# Altium schematic sheet MCU.SchDoc: Wacky Racers Racer
size A3; DrawnBy: Mark Arunchayanon, Abhi Chhabara, Luke Trenberth, Sasiru Goonatilake; Address1: ECE Department; Address2: University of Canterbury; Address3: Christchurch 8041; Address4: New Zealand; Revision: 1
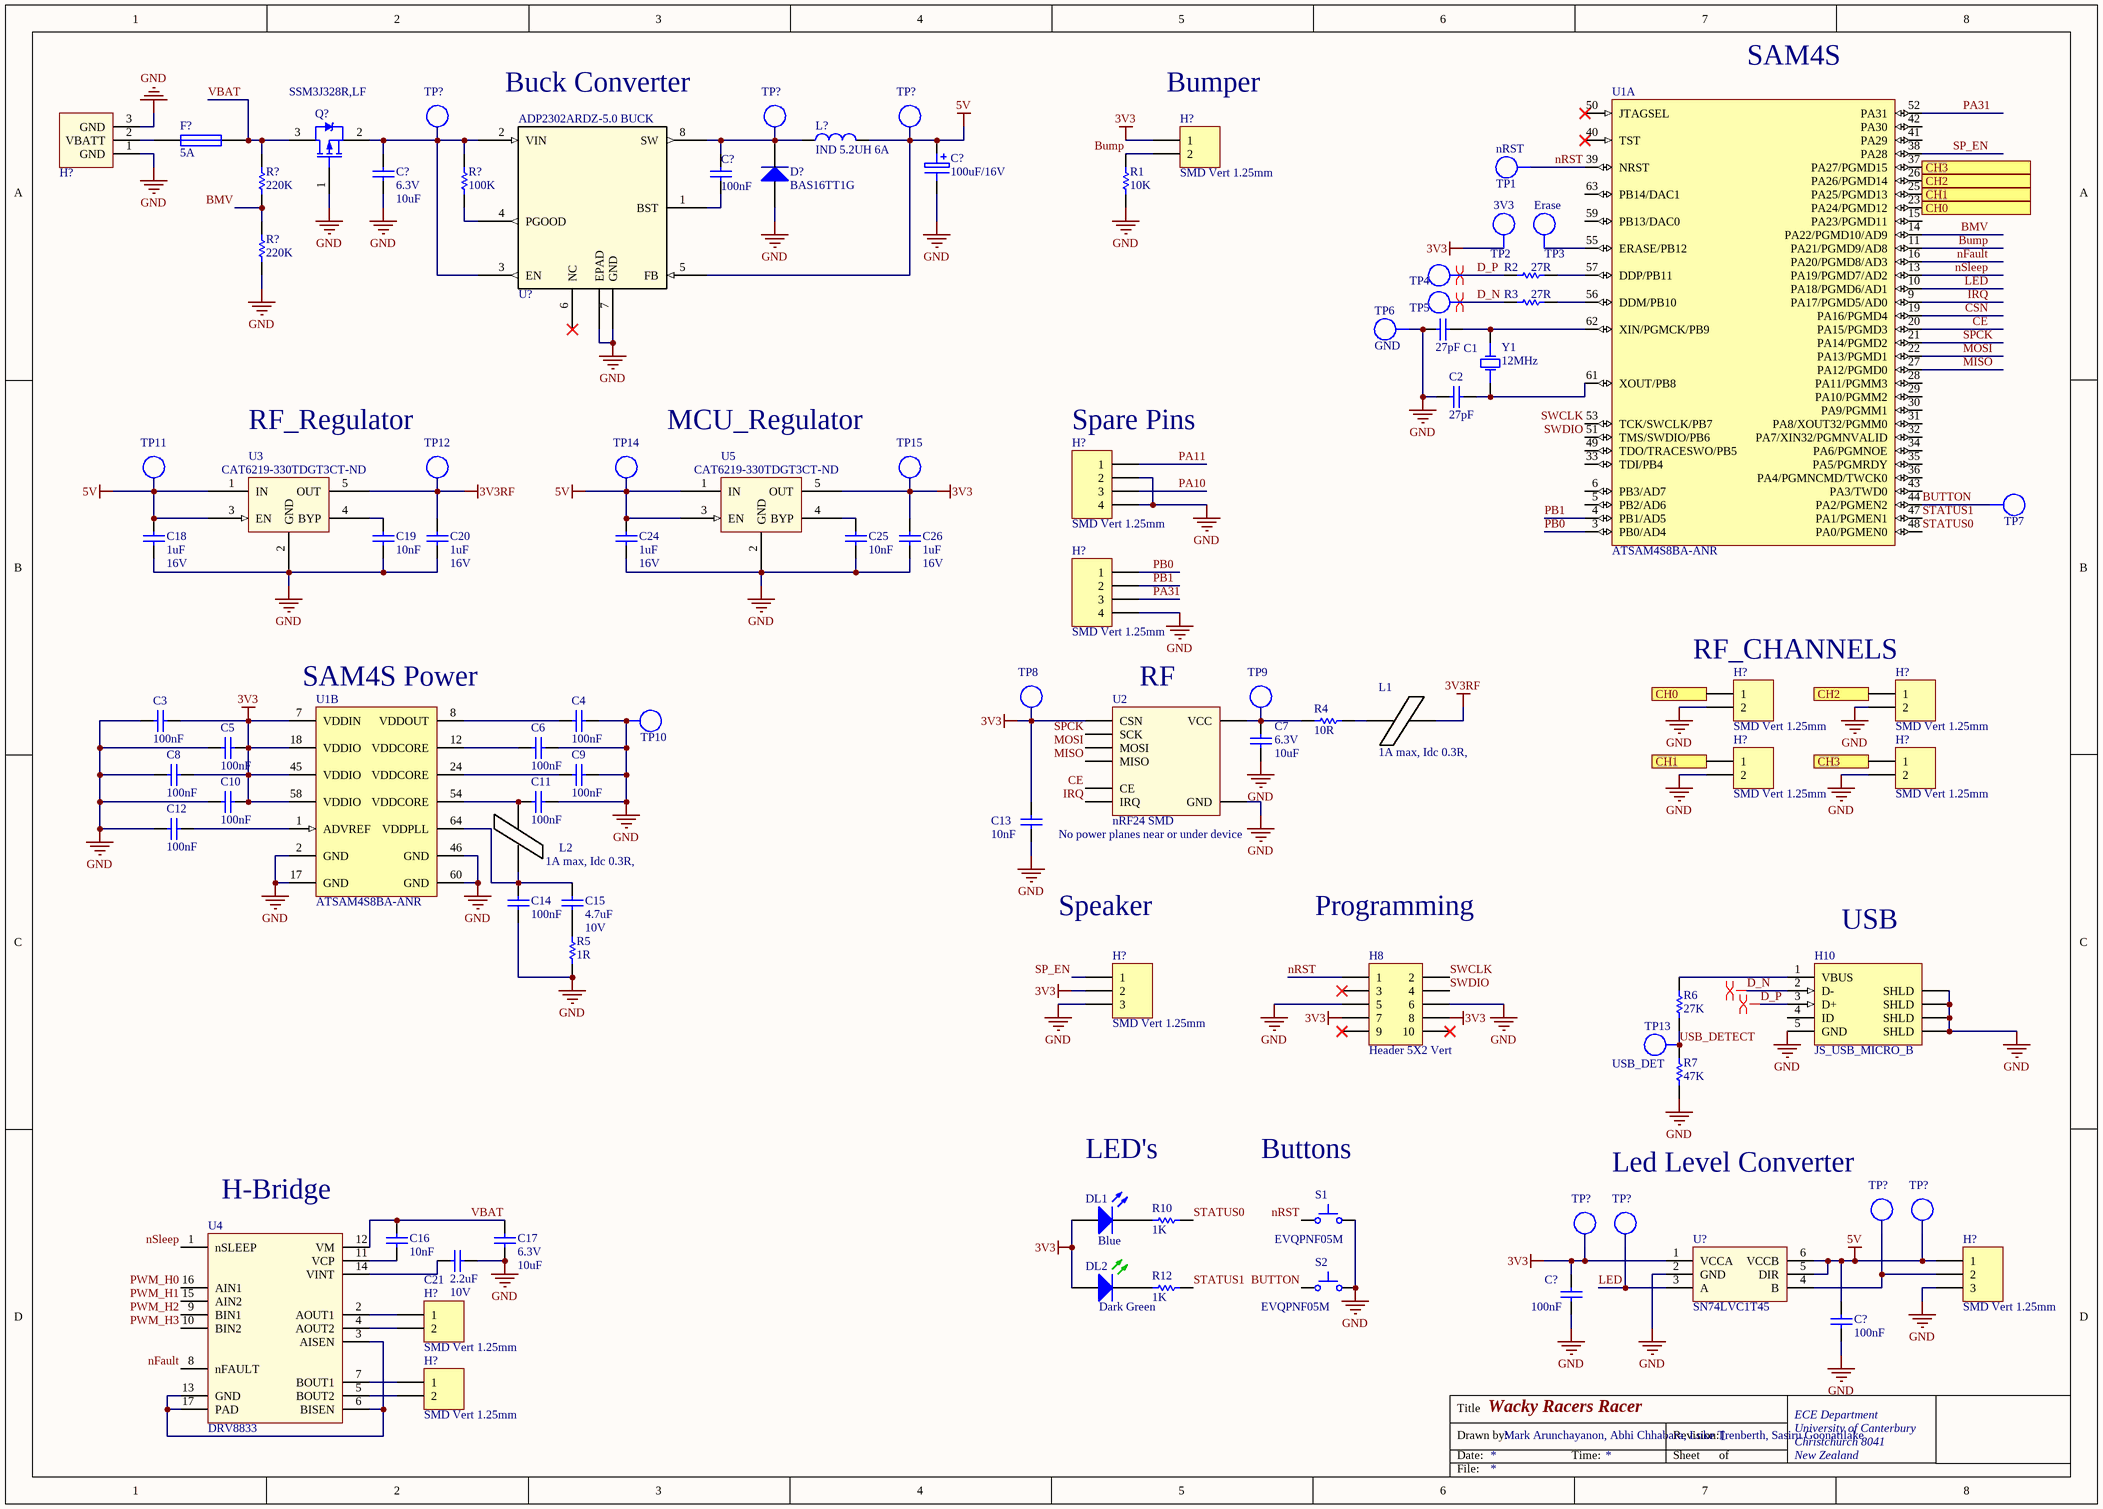
[diagram p0: MCU.SchDoc]

## Parts
(Parts that share a designator on the sheet are numbered #1, #2 ... from top to bottom, then left to right.)
C1  27pF  [CAPC1608L]
C2  27pF  [CAPC1608L]
C3  100nF  [CAPC1608L]
C4  100nF  [CAPC1608L]
C5  100nF  [CAPC1608L]
C6  100nF  [CAPC1608L]
C7  Voltage - Rated: 6.3V  [CAPC1608L]  (hidden comment: 10uF)
C8  100nF  [CAPC1608L]
C9  100nF  [CAPC1608L]
C10  100nF  [CAPC1608L]
C11  100nF  [CAPC1608L]
C12  100nF  [CAPC1608L]
C13  10nF  [CAPC1608L]
C14  100nF  [CAPC1608L]
C15  Max Voltage: 10V  [CAPC1608N]  (hidden comment: 4.7uF)
C16  10nF  [CAPC1608L]
C17  Voltage - Rated: 6.3V  [CAPC1608L]  (hidden comment: 10uF)
C18  Max Voltage: 16V  [CAPC1608L]  (hidden comment: 1uF)
C19  10nF  [CAPC1608L]
C20  Max Voltage: 16V  [CAPC1608L]  (hidden comment: 1uF)
C21  Max Voltage: 10V  [CAPC1608L]  (hidden comment: 2.2uF)
C24  Max Voltage: 16V  [CAPC1608L]  (hidden comment: 1uF)
C25  10nF  [CAPC1608L]
C26  Max Voltage: 16V  [CAPC1608L]  (hidden comment: 1uF)
C?#1  100nF  [CAPC1608L]
C?#2  100uF/16V  [NICH-1]
C?#3  Voltage - Rated: 6.3V  [CAPC1608L]  (hidden comment: 10uF)
C?#4  100nF  [CAPC1608L]
C?#5  100nF  [CAPC1608L]
D?  BAS16TT1G  [SOT416]
DL1  Blue  [WL-SMCW0603]
DL2  Dark Green  [WL-SMCW0603]
F?  5A  [RESC3216N]
H8  Header 5X2 Vert  [IDC2.54-V10D]
H10  JS_USB_MICRO_B  [FCI_USB_10118194-0001LF]
H?#1  SMD Vert 1.25mm  [SD-53398-0219]
H?#2  Battery_HEADER_3pin  [BATT_HEADER_3POS]  (value not drawn)
H?#3  SMD Vert 1.25mm  [SD-53398-0419]
H?#4  SMD Vert 1.25mm  [SD-53398-0419]
H?#5  SMD Vert 1.25mm  [SD-53398-0219]
H?#6  SMD Vert 1.25mm  [SD-53398-0219]
H?#7  SMD Vert 1.25mm  [SD-53398-0219]
H?#8  SMD Vert 1.25mm  [SD-53398-0219]
H?#9  SMD Vert 1.25mm  [SD-53398-0319]
H?#10  SMD Vert 1.25mm  [SD-53398-0319]
H?#11  SMD Vert 1.25mm  [SD-53398-0219]
H?#12  SMD Vert 1.25mm  [SD-53398-0219]
L1  1A max, Idc 0.3R,  [INDC3216L]
L2  1A max, Idc 0.3R,  [INDC3216L]
L?  IND 5.2UH 6A  [INDUCTOR5u2]
Q?  SSM3J328R,LF  [SOT23_L]
R1  10K  [RESC1608L]
R2  27R  [RESC3216L]
R3  27R  [RESC3216L]
R4  10R  [RESC1608L]
R5  1R  [RESC3216L]
R6  27K  [RESC1608L]
R7  47K  [RESC1608N]
R10  1K  [RESC1608L]
R12  1K  [RESC1608L]
R?#1  220K  [RESC1608L]
R?#2  100K  [RESC1608L]
R?#3  220K  [RESC1608L]
S1  EVQPNF05M  [EVQPNF05M]
S2  EVQPNF05M  [EVQPNF05M]
TP1  nRST  [TP_1206]  (no BOM)
TP2  3V3  [TP_1206]  (no BOM)
TP3  Erase  [TP_1206]  (no BOM)
TP4  TP  [TP_1206]  (value not drawn)  (no BOM)
TP5  TP  [TP_1206]  (value not drawn)  (no BOM)
TP6  GND  [TP_1206]  (no BOM)
TP7  TP  [TP_1206]  (value not drawn)  (no BOM)
TP8  TP_0603  [TP_0603]  (value not drawn)
TP9  TP_0603  [TP_0603]  (value not drawn)
TP10  TP  [TP_1206]  (value not drawn)  (no BOM)
TP11  TP_0603  [TP_0603]  (value not drawn)
TP12  TP_0603  [TP_0603]  (value not drawn)
TP13  USB_DET  [TP_1206]  (no BOM)
TP14  TP_0603  [TP_0603]  (value not drawn)
TP15  TP_0603  [TP_0603]  (value not drawn)
TP?#1  TP_0603  [TP_0603]  (value not drawn)
TP?#2  TP_0603  [TP_0603]  (value not drawn)
TP?#3  TP_0603  [TP_0603]  (value not drawn)
TP?#4  TP_0603  [TP_0603]  (value not drawn)
TP?#5  TP_0603  [TP_0603]  (value not drawn)
TP?#6  TP_0603  [TP_0603]  (value not drawn)
TP?#7  TP_0603  [TP_0603]  (value not drawn)
U1  ATSAM4S8BA-ANR  [LQFP64_L]  (parts A,B of 2)
U2  nRF24 SMD  Warning: No power planes near or under device  [NRF24]
U3  Supplier Part Number: CAT6219-330TDGT3CT-ND  [SOT95P280X145-5N]  (hidden comment: CAT6219-330TDGT3)
U4  DRV8833  [HTSOP16]
U5  Supplier Part Number: CAT6219-330TDGT3CT-ND  [SOT95P280X145-5N]  (hidden comment: CAT6219-330TDGT3)
U?#1  ADP2302ARDZ-5.0 BUCK  [RD_8_1]
U?#2  SN74LVC1T45  [SOT23-6_N]
Y1  12MHz  [HC49/4h_SMX]

## Ports
CH0 (in), CH0 (out), CH1 (in), CH1 (out), CH2 (in), CH2 (out), CH3 (in), CH3 (out)

## Nets
3V3: C3.2 C5.2 C8.2 C10.2 C13.2 C26.2 C?#4.1 DL1.2(A) DL2.2(A) H8.7 H8.8 H?#1.1 H?#9.2 TP2.1 TP8.1(TP) TP15.1(TP) TP?#6.1(TP) U1.7(VDDIN) U1.18(VDDIO) U1.45(VDDIO) U1.58(VDDIO) U2.4(CSN) U5.5(OUT) U?#2.1(VCCA)
3V3RF: C20.2 L1.2 TP12.1(TP) U3.5(OUT)
5V: C18.2 C24.2 C?#2.2 C?#5.1 H?#10.1 L?.2 TP11.1(TP) TP14.1(TP) TP?#3.1(TP) TP?#5.1(TP) U3.1(IN) U3.3(EN) U5.1(IN) U5.3(EN) U?#1.5(FB) U?#2.5(DIR) U?#2.6(VCCB)
GND: C1.2 C2.2 C3.1 C4.2 C5.1 C6.2 C7.1 C8.1 C9.2 C10.1 C11.2 C12.1 C13.1 C14.1 C17.1 C18.1 C19.1 C20.1 C21.2 C24.1 C25.1 C26.1 C?#2.1 C?#3.1 C?#4.2 C?#5.2 D?.1(A) H8.5 H8.6 H10.5(GND) H10.6(SHLD) H?#2.1(GND) H?#2.3(GND) H?#3.2 H?#3.4 H?#4.4 H?#5.2 H?#6.2 H?#7.2 H?#8.2 H?#9.3 H?#10.3 Q?.1 R1.1 R5.1 R7.1 R?#3.1 S1.2 S2.2 TP6.1 TP10.1 U1.2(GND) U1.17(GND) U1.46(GND) U1.60(GND) U2.2(GND) U3.2(GND) U5.2(GND) U?#1.7(GND) U?#1.EPAD U?#2.2(GND)
BMV: R?#1.1 R?#3.2 U1.14(PA22/PGMD10/AD9)
Bump: H?#1.2 R1.2 U1.11(PA21/PGMD9/AD8)
BUTTON: S2.1 TP7.1 U1.44(PA2/PGMEN2)
CE: U1.20(PA15/PGMD3) U2.3(CE)
CH0: H?#5.1 U1.23(PA24/PGMD12) ; port CH0
CH1: H?#7.1 U1.25(PA25/PGMD13) ; port CH1
CH2: H?#6.1 U1.26(PA26/PGMD14) ; port CH2
CH3: H?#8.1 U1.37(PA27/PGMD15) ; port CH3
CSN: U1.19(PA16/PGMD4)
D_N: H10.2(D-) R3.1 TP5.1
D_P: H10.3(D+) R2.1 TP4.1
IRQ: U1.9(PA17/PGMD5/AD0) U2.8(IRQ)
LED: TP?#7.1(TP) U1.10(PA18/PGMD6/AD1) U?#2.3(A)
MISO: U1.27(PA12/PGMD0) U2.7(MISO)
MOSI: U1.22(PA13/PGMD1) U2.6(MOSI)
nFault: U1.16(PA20/PGMD8/AD3) U4.8(nFAULT)
nRST: H8.1 S1.1 TP1.1 U1.39(NRST)
nSleep: U1.13(PA19/PGMD7/AD2) U4.1(nSLEEP)
PA10: H?#3.3
PA11: H?#3.1
PA31: H?#4.3 U1.52(PA31)
PB0: H?#4.1 U1.3(PB0/AD4)
PB1: H?#4.2 U1.4(PB1/AD5)
PWM_H0: U4.16(AIN1)
PWM_H1: U4.15(AIN2)
PWM_H2: U4.9(BIN1)
PWM_H3: U4.10(BIN2)
SP_EN: H?#9.1 U1.38(PA28)
SPCK: U1.21(PA14/PGMD2) U2.5(SCK)
STATUS0: R10.2 U1.48(PA0/PGMEN0)
STATUS1: R12.2 U1.47(PA1/PGMEN1)
SWCLK: H8.2 U1.53(TCK/SWCLK/PB7)
SWDIO: H8.4 U1.51(TMS/SWDIO/PB6)
USB_DETECT: R6.1 R7.2 TP13.1
VBAT: C16.1 C17.2 F?.2 Q?.3 R?#1.2 U4.12(VM)
NetC1_1: C1.1 U1.62(XIN/PGMCK/PB9) Y1.2(OSC2)
NetC2_1: C2.1 U1.61(XOUT/PB8) Y1.1(OSC1)
NetC4_1: C4.1 U1.8(VDDOUT)
NetC6_1: C6.1 U1.12(VDDCORE)
NetC7_2: C7.2 R4.1 TP9.1(TP) U2.1(VCC)
NetC9_1: C9.1 U1.24(VDDCORE)
NetC11_1: C11.1 L2.2 U1.54(VDDCORE)
NetC12_2: C12.2 U1.1(ADVREF)
NetC14_2: C14.2 C15.2 L2.1 U1.64(VDDPLL)
NetC15_1: C15.1 R5.2
NetC16_2: C16.2 U4.11(VCP)
NetC19_2: C19.2 U3.4(BYP)
NetC21_1: C21.1 U4.14(VINT)
NetC25_2: C25.2 U5.4(BYP)
NetC?#1_1: C?#1.1 D?.3(K) L?.1 TP?#2.1(TP) U?#1.8(SW)
NetC?#1_2: C?#1.2 U?#1.1(BST)
NetC?#3_2: C?#3.2 Q?.2 R?#2.2 TP?#1.1(TP) U?#1.2(VIN) U?#1.3(EN)
NetDL1_1: DL1.1(K) R10.1
NetDL2_1: DL2.1(K) R12.1
NetF?_1: F?.1 H?#2.2(VBATT)
NetH10_1: H10.1(VBUS) R6.2
NetH?#10_2: H?#10.2 TP?#4.1(TP) U?#2.4(B)
NetH?#11_1: H?#11.1 U4.2(AOUT1)
NetH?#11_2: H?#11.2 U4.4(AOUT2)
NetH?#12_1: H?#12.1 U4.7(BOUT1)
NetH?#12_2: H?#12.2 U4.5(BOUT2)
NetL1_1: L1.1 R4.2
NetR2_2: R2.2 U1.57(DDP/PB11)
NetR3_2: R3.2 U1.56(DDM/PB10)
NetR?#2_1: R?#2.1 U?#1.4(PGOOD)
NetTP3_1: TP3.1 U1.55(ERASE/PB12)
NetU4_3: U4.3(AISEN) U4.6(BISEN) U4.13(GND) U4.17(PAD)

Not connected (* = marked no-connect by the designer): H8 3* 9* 10*; H10 4(ID); U1 5(PB2/AD6) 6(PB3/AD7) 15(PA23/PGMD11) 28(PA11/PGMM3) 29(PA10/PGMM2) 30(PA9/PGMM1) 31(PA8/XOUT32/PGMM0) 32(PA7/XIN32/PGMNVALID) 33(TDI/PB4) 34(PA6/PGMNOE) 35(PA5/PGMRDY) 36(PA4/PGMNCMD/TWCK0) 40(TST)* 41(PA29) 42(PA30) 43(PA3/TWD0) 49(TDO/TRACESWO/PB5) 50(JTAGSEL)* 59(PB13/DAC0) 63(PB14/DAC1); U?#1 6(NC)*

## Layout directives
differential pair: D_N, D_P

## Notes on the sheet
- (near U?#1) Buck Converter
- (near H?#1) Bumper
- (near U1) SAM4S
- RF_Regulator
- MCU_Regulator
- (near H?#3) Spare Pins
- (near U1) SAM4S Power
- (near U2) RF
- (near H?#5) RF_CHANNELS
- Speaker
- Programming
- (near H10) USB
- LED's
- Buttons
- (near TP?#4) Led Level Converter
- H-Bridge
- Title
- Drawn by:
- Date:
- Time:
- Revision:
- Sheet
- of
- File:

## Library data of the parts
C1 C2 = CC_27pF_0603: CAP CER 27pF NPO/COG +-5% 50V 0603; PackageReference: 0603; Code_IPC: 1608 [0603]; Verify: *; Supplier: ECE Dept; Storage Location: PCB Assembly WS; Value: 27pF
C3-C6 C8-C12 C14 C?#1 C?#4 C?#5 = CC_100nF_0603: CAP CER 100nF X7R +-10% 50V 0603; PackageReference: 0603; Code_IPC: 1608 [0603]; Verify: *; Supplier: ECE Dept; Storage Location: PCB Assembly WS; Value: 100nF
C7 C17 C?#3 = CC_10uF_0603: CAP CER 10UF X5R +-20% 6V3 0603; Supplier: ECE Dept; Storage Location: PCB Assembly WS; Value: 10uF
C13 C16 C19 C25 = CC_10nF_0603: CAP CER 10nF X7R +-10% 50V 0603; PackageReference: 0603; Code_IPC: 1608 [0603]; Verify: *; Supplier: ECE Dept; Storage Location: PCB Assembly WS; Value: 10nF
C15 = CC_4.7uF_0603: CAP CER 4.7uF X5R +-20%  10V 0603; Note: Footprint corresponds to dimensions for bulk cassette packaging. This case size has tightened tolerances.; PackageReference: 0805; Code_IPC: 2012[0805]; Verify: *; Supplier: ECE Dept; Storage Location: PCB Assembly WS; Value: 4.7uF
C18 C20 C24 C26 = CC_1uF_0603: CAP CER 1uF Y5V -20% +80% 16V 0603; PackageReference: 0603; Code_IPC: 1608 [0603]; Verify: *; Supplier: ECE Dept; Storage Location: PCB Assembly WS; Value: 1uF
C21 = CC_2.2uF_0603: CAP CER 2.2uF X5R +-20% 10V 0603; PackageReference: 0603; Code_IPC: 1608 [0603]; Verify: *; Supplier: ECE Dept; Storage Location: PCB Assembly WS; Value: 2.2uF
C?#2 = CA_100uF_16V: CAP ALUM 100uF 16V SMD; Manufacturer PN: UWX1C101MCL1GB; Manufacturer: Nichcon; Supplier 1: Farnell; Supplier Part Number 1: 1870677; Storage Location: PCB Assembly WS; Supplier: ECE Dept; Supplier 2: Digi-Key; Supplier Part Number 2: 493-2105-1-ND; Value: 100uF/16V
D? = DR_BAS16TT1G: Diode Switching, Vr 75V, 200mA, SOT-416; Manufacturer: ON Semiconductor; Max Surge Current: 500mA; Forward Voltage: 1.25V; Peak Reverse Current: 1uA; Recovery Time: 6ns; Power Dissipation: 225mW; Element Configuration: Single; Polarity: Standard; Max Reverse Voltage (DC): 100V; Manufacturer PN: BAS16TT1G; Storage Location: PCB Assembly WS; Supplier: ECE Dept; Manufacturer Part Number: BAS16TT1G; Case/Package: SOT-416-3; Number of Pins: 3; Contact Plating: Tin,Matte; Min Operating Temperature: -55°C; Max Operating Temperature: 150°C; Package Quantity: 1; Packaging: Tape and Reel; Forward Current: 200mA; Average Rectified Current: 200mA; Reverse Recovery Time: 6ns; Peak Non-Repetitive Surge Current: 500mA; Max Repetitive Reverse Voltage (Vrrm): 75V; Max Forward Surge Current (Ifsm): 500mA; Current Rating: 200mA; Output Current: 200mA; Length: 1.65mm; Height: 0.9mm; Width: 0.9mm; Radiation Hardening: No; REACH SVHC: No SVHC; Lead Free: Lead Free; Halogen Free: Halogen Free; ComponentLink1URL: https://datasheet.ciiva.com/8299/bas16tt1-d-8299729.pdf; ComponentLink1Description: https://datasheet.ciiva.com/8299/bas16tt1-d-8299729.pdf; ComponentLink2URL: https://datasheet.ciiva.com/4435/bas16tt1-d-103455-4435027.pdf; ComponentLink2Description: https://datasheet.ciiva.com/4435/bas16tt1-d-103455-4435027.pdf; ComponentLink3URL: https://datasheet.ciiva.com/28646/bas16tt1-d-28646580.pdf; ComponentLink3Description: https://datasheet.ciiva.com/28646/bas16tt1-d-28646580.pdf; ComponentLink4URL: https://datasheet.ciiva.com/16393/bas16tt1-d-16393622.pdf; ComponentLink4Description: https://datasheet.ciiva.com/16393/bas16tt1-d-16393622.pdf; ComponentLink5URL: https://datasheet.ciiva.com/923/bas16tt1-d-923016.pdf; ComponentLink5Description: https://datasheet.ciiva.com/923/bas16tt1-d-923016.pdf; ComponentLink6URL: https://datasheet.ciiva.com/923/bas16tt1-d-923017.pdf; ComponentLink6Description: https://datasheet.ciiva.com/923/bas16tt1-d-923017.pdf; ComponentLink7URL: https://datasheet.ciiva.com/923/bas16tt1-d-923018.pdf; ComponentLink7Description: https://datasheet.ciiva.com/923/bas16tt1-d-923018.pdf; ComponentLink8URL: https://datasheet.ciiva.com/25930/bas16tt1-d-25930986.pdf; ComponentLink8Description: https://datasheet.ciiva.com/25930/bas16tt1-d-25930986.pdf; Supplier 1: Digi-Key; Supplier 2: Farnell; Supplier Part Number 2: 2844752; Supplier Part Number 1: BAS16TT1GOSDKR-ND; Value: BAS16TT1G
DL1 = DL_150060BS75000: LED Blue 270mcd 0603 SMD; Manufacturer: WURTH ELEKTRONIK; Forward Current If: 30; Forward Voltage: 3.2; Luminous Intensity: 270; Viewing Angle: 120°; Wavelength Typ: 470; Pricing: 1=0.3844, 50=0.3252, 100=0.2957, 500=0.2365 (NZD); Supplier 1: Farnell; Supplier Part Number 1: 2322069; Manufacturer Part Number: 150060BS75000; Storage Location: PCB Assembly WS; Supplier: ECE Dept; LED Colour: Blue
DL2 = DL_150060GS75000: LED Dk Green 430mcd 0603 SMD; Manufacturer: WURTH ELEKTRONIK; Forward Current If: 30; Wavelength Typ: 520; Forward Voltage: 3.2; Lens Shape: Rectangular; Luminous Intensity: 430; Viewing Angle: 140°; LED Mounting: SMD; Supplier 1: Farnell; Supplier Part Number 1: 2322070; Manufacturer Part Number: 150060GS75000; Storage Location: PCB Assembly WS; Supplier: ECE Dept; LED Colour: Dark Green
F? = FS_Fuse_5.0A: Fuse 5.0A Fast Acting 1206 SMD; Manufacturer Part Number: C1F5; Manufacturer: Bel TRP; Voltage Rating (AC): 125V; Voltage Rating (DC): 63V; DC Cold Resistance: 19mR; Fuse Type: Board Mount (Cartridge Style Excluded); Approvals: CE,cURus; Mount: Surface Mount; Case/Package: 1206; Number of Pins: 2; Case Code (Metric): 3216; Case Code (Imperial): 1206; Contact Plating: Nickel,Tin; Min Operating Temperature: -55°C; Max Operating Temperature: 125°C; Packaging: Tape and Reel; Voltage Rating: 125V; Length: 0.126inch; Width: 0.062inch; Supplier 1: Digi-Key; Stock 1: 725; Pricing 1: 1=0.32, 5=0.312, 10=0.298, 50=0.2662, 100=0.2479, 250=0.22032, 500=0.1836, 1000=0.17442 (USD); ComponentLink1URL: http://www.farnell.com/datasheets/2571625.pdf; ComponentLink1Description: http://www.farnell.com/datasheets/2571625.pdf; ComponentLink2URL: http://belfuse.com/pdfs/C1F.pdf; ComponentLink2Description: http://belfuse.com/pdfs/C1F.pdf; ComponentLink3URL: http://www.mouser.com/ds/2/643/C1F-594910.pdf; ComponentLink3Description: http://www.mouser.com/ds/2/643/C1F-594910.pdf; ComponentLink4URL: https://belfuse.com/resources/StewartConnector/C1F.pdf; ComponentLink4Description: https://belfuse.com/resources/StewartConnector/C1F.pdf; Current Rating: 5A; Supplier Part Number 1: 507-1886-1-ND; Supplier 2: Element14; Supplier Part Number 2: 2848595; Value: 5A
H8 = JA_HDR_IDC_5X2_VERT: IDC Header, 2,54mm, 10-Pin, Vert; Supplier: ECE Dept; Supplier 1: Farnell; Supplier Part Number 1: 1096985; Storage Location: ECE Dept Store
H10 = JS_USB_MICRO_B_SMT: CONN USB MICRO B RECPT SMT R/A; Manufacturer: FCI; Manufacturer Part Number: 10118194-0001LF; Gender: Receptacle; Number of Contacts: 5; Specifications: USB 2.0; Supplier 1: Digi-Key; Supplier Part Number 1: 609-4618-1-ND; Features: Shielded, Solder Retention; Mounting Type: Surface Mount, Right Angle, Horizontal
H?#1 H?#5-H?#8 H?#11 H?#12 = JB_53398-02: Header_Vert_2Pos_1.25mm_125V@1A_SMT; Manufacturer: Molex Inc; Manufacturer Part Number: 0533980271; Number of Positions: 2; Pitch: 0.049" (1.25mm); Contact Type: Blade Pin; Mounting Type: Surface Mount; Supplier 1: Digi-Key; Supplier Part Number 1: WM7606CT-ND; Supplier: ECE Dept; Storage Location: PCB Assembly WS; Value: SMD Vert 1.25mm
H?#2 = Battery_HEADER_3pin: 3Pin Header 2.54mm spacing
H?#3 H?#4 = JB_53398-04: Header_Vert_4Pos_1.25mm_125V@1A_SMT; Manufacturer: MOLEX; Manufacturer Part Number: 53398-0471; Contact Termination: Surface Mount Vertical; Current Rating: 1; Lead Spacing: 1.25; Series: PicoBlade; Supplier 1: Farnell; Supplier Part Number 1: 1125367; Supplier: ECE Dept; Storage Location: PCB Assembly WS; Value: SMD Vert 1.25mm
H?#9 H?#10 = JB_53398-03: Header_Vert_3Pos_1.25mm_125V@1A_SMT; Manufacturer: MOLEX; Manufacturer Part Number: 53398-0371; Contact Termination: Surface Mount Vertical; Current Rating: 1; External Depth: 3.7; External Length / Height: 4.7; Gender: Header; No. of Contacts: 3; Series: PicoBlade; Supplier 1: Farnell; Supplier Part Number 1: 1125353; Supplier: ECE Dept; Storage Location: PCB Assembly WS; Value: SMD Vert 1.25mm
L1 L2 = IN_Ferrite-Bead: Ferrite Bead, Rdc 0.3R, Z100MHZ 600R, Imax 1A, SMD 1206; Manufacturer: FAIR-RITE; Manufacturer PN: 2512066017Y1; DC Current Rating: 1; DC Resistance Max: 0.08; Ferrite Case Style: 1206 ^3216 Metric]; Frequency Range: 50MHz to 1; Impedance: 600; Impedance Tolerance: ± 25%; Supplier: ECE Dept; Storage Location: PCB Assembly WS; Ferrite Mounting: SMD; Supplier 1: Farnell; Supplier Part Number 1: 1612060; Manufacturer Part Number: 2512066017Y1; Value: 1A max, Idc 0.3R,
L? = CDRH104RNP-5R2NC: FIXED IND 5.2UH 6A 22 MOHM SMD; Manufacturer: Sumida America Components Inc.; Material - Core: Ferrite; Tolerance: ±30%; Current - Saturation: 5.6A; Shielding: Shielded; DC Resistance (DCR): 22 mOhm Max; Supplier 1: Digi-Key; Manufacturer Part Number: CDRH104RNP-5R2NC; RoHS: RoHS Compliant; Category: Inductors, Coils, Chokes; Stock 1: 3849; Pricing 1: 1=2.9, 10=2.678, 100=1.8743, 500=1.5173 (NZD); Packaging: Cut Tape (CT); Part Status: Active; Type: -; Q @ Freq: -; Frequency - Self Resonant: -; Ratings: -; Operating Temperature: -40°C ~ 100°C; Mounting Type: Surface Mount; Package / Case: Nonstandard; Supplier Device Package: -; Size / Dimension: 0.402" L x 0.394" W (10.20mm x 10.00mm); Height - Seated (Max): 0.157" (4.00mm); ComponentLink1URL: http://products.sumida.com/products/pdf/CDRH104R.pdf; ComponentLink1Description: http://products.sumida.com/products/pdf/CDRH104R.pdf; Supplier Part Number 1: 308-2280-1-ND
Q? = TM_SSM3J328R: MOSFET P-CH 20V 6A SOT23-3; Manufacturer: Toshiba; FET Feature: Logic Level Gate, 1.5V Drive; FET Type: MOSFET P-Channel, Metal Oxide; Gate Charge (Qg) @ Vgs: 12.8nC @ 4.5V; Input Capacitance (Ciss) @ Vds: 840pF @ 10V; Power - Max: 1W; Rds On Max: 29.8mR; Drain to Source Resistance: 47.4mR; Turn-On Delay Time: 32ns; Power Dissipation: 2W; Number of Channels: 1; Turn-Off Delay Time: 107ns; Gate to Source Voltage (Vgs): 8V; Input Capacitance: 840pF; Element Configuration: Single; Drain to Source Breakdown Voltage: -20V; Vgs(th) (Max) @ Id: 1V @ 1mA; Current - Continuous Drain (Id) @ 25° C: 6A; Drain to Source Voltage (Vdss): 20V; Package / Case: SOT-23-3 Flat Leads; Supplier Device Package: SOT-23F; Pricing: 1=0.79, 10=0.658, 25=0.5772, 100=0.4939, 250=0.42836, 500=0.36284, 1000=0.27972 (NZD); Storage Location: PCB Assembly WS; Supplier: Digi-Key; ComponentLink1URL: https://datasheet.ciiva.com/11158/ssm3j328r-datasheet-en-20140301-11158652.pdf; ComponentLink1Description: https://datasheet.ciiva.com/11158/ssm3j328r-datasheet-en-20140301-11158652.pdf; Supplier Part Number: SSM3J328RLFDKR-ND; Max Operating Temperature: 150°C; Mount: Surface Mount; Packaging: Tape and Reel; Min Operating Temperature: -55°C; Continuous Drain Current (ID): 6A; Radiation Hardening: No; Max Power Dissipation: 1W; Package Quantity: 3000; Case/Package: SOT-23-3; Number of Pins: 3; Number of Elements: 1; Supplier 1: Digi-Key; Supplier Part Number 1: SSM3J328RLFDKR-ND; Manufacturer Part Number: SSM3J328R,LF
R1 = RS_10K: RES 10.0K OHM 1/10W 5% 0603 SMD; Storage Location: PCB Assembly WS; Supplier: ECE Dept; Value: 10K
R2 R3 = RT_27R: RES 27R OHM 1/4W 5% 1206 SMD; Storage Location: PCB Assembly WS; Supplier: ECE Dept; Value: 27R
R4 = RS_10R: RES 10 OHM 1/10W 5% 0603 SMD; Storage Location: PCB Assembly WS; Supplier: ECE Dept; Value: 10R
R5 = RT_1R: RES 1R OHM 1/4W 5% 1206 SMD; Storage Location: PCB Assembly WS; Supplier: ECE Dept; Value: 1R
R6 = RS_27K: RES 27K OHM 1/10W 5% 0603 SMD; Storage Location: PCB Assembly WS; Supplier: ECE Dept; Value: 27K
R7 = RS_47K: RES 47.0K OHM 1/10W 5% 0603 SMD; Storage Location: PCB Assembly WS; Supplier: ECE Dept; Value: 47K
R10 R12 = RS_1K: RES 1.0K OHM 1/10W 5% 0603 SMD; Storage Location: PCB Assembly WS; Supplier: ECE Dept; Value: 1K
R?#1 R?#3 = RS_220K: RES 3.3K OHM 1/10W 5% 0603 SMD; Storage Location: PCB Assembly WS; Supplier: ECE Dept; Value: 220K
R?#2 = RS_100K: RES 100K OHM 1/10W 5% 0603 SMD; Storage Location: PCB Assembly WS; Supplier: ECE Dept; Value: 100K
S1 S2 = WS_EVQPNF05M: Panasonic 6 x 3.5mm SMD Light Touch Switch Type SMD; PackageDescription: 6.0 x 3.5 mm; Supplier 1: Farnell; Supplier Part Number 1: 2079481; Manufacturer: Panasonic; Manufacturer PN: EVQPNF05M; Supplier 2: Digi-Key; Supplier Part Number 2: P13598SCT-ND; Storage Location: PCB Assembly WS; Supplier: ECE Dept
TP1-TP3 TP6 TP13 = TP_1206: Test-Point 3.3x1.6x2.1mm SMD; Manufacturer: Harwin Inc; Manufacturer Part Number: S1751-46R; Value: TP; Manufacturer PN: *; Storage Location: ProtoPlace; Mounting Type: Surface Mount; Type: PC Test Point; Supplier 1: Digi-Key; Supplier Part Number 1: 952-1478-2-ND; Supplier 2: Farnell; Supplier Part Number 2: 1826282; Supplier: ECE Dept
TP4 TP5 TP7 TP10 = TP_1206: Test-Point 3.3x1.6x2.1mm SMD; Manufacturer: Harwin Inc; Manufacturer Part Number: S1751-46R; Manufacturer PN: *; Storage Location: ProtoPlace; Mounting Type: Surface Mount; Type: PC Test Point; Supplier 1: Digi-Key; Supplier Part Number 1: 952-1478-2-ND; Supplier 2: Farnell; Supplier Part Number 2: 1826282; Supplier: ECE Dept; Value: TP
TP8 TP9 TP11 TP12 TP14 TP15 TP?#1-TP?#7 = TP_0603: Test Point 1.65X0.9X1.2mm SMD; Manufacturer: TE Connectivity AMP Connectors; Manufacturer Part Number: 1625854-3; Supplier 1: Digi-Key; Mounting Type: Surface Mount; Terminal: 0.063" x 0.031" x 0.045" (1.60mm x 0.80mm x 1.15mm); Type: PC Test Point; Supplier Part Number 1: A106145CT-ND
U1 = SE_ATSAM4S16BA-MU: IC MCU 32BIT 512KB FLASH 64LQFP; Manufacturer: Atmel; Connectivity: I²C, IrDA, Memory Card, SPI, SSC, UART/USART, USB; Core Processor: ARM® Cortex®-M4; Core Size: 32-Bit; Data Converters: A/D 11x12b, D/A 2x12b; Number of I/O: 47; Peripherals: Brown-out Detect/Reset, DMA, POR, PWM, WDT; Program Memory Size: 512KB (512K x 8); RAM Size: 128K x 8; Speed: 120MHz; Voltage - Supply (Vcc/Vdd): 1.62 V ~ 3.6 V; PackageVersion: revJ, Jul-2007; PackageReference: 64PS; PackageDescription: 64-Pin Quad Flat No-Lead (QFN) Sawn, 9 x 9 x 1.0 mm Body, 0.5 mm Pitch, Exposed Pad; Code_JEDEC: MO-220VMMD-3; ComponentLink1Description: Manufacturer URL; ComponentLink1URL: http://www.atmel.com/; ComponentLink2Description: SAM4S Series Datasheet; ComponentLink2URL: http://www.atmel.com/dyn/resources/prod_documents/11100.pdf; ComponentLink3Description: SAM4S Series Summary; ComponentLink3URL: http://www.atmel.com/dyn/resources/prod_documents/11100S.pdf; Supplier 1: Digi-Key; Package / Case: 64-LQFP; Packaging: Cut Tape (CT); Program Memory Type: FLASH; Supplier Part Number 1: ATSAM4S8BA-ANRCT-ND; Manufacturer Part Number: ATSAM4S8BA-ANR
U2 = NRF24: nRF24 SMD Module
U3 U5 = SV_CAT6219-330TDGT3: IC REG LIN 3.3V 500MA TSOT23-5; Voltage - Input (Max): 5.5V; Voltage Dropout (Max): 0.5V @ 500mA; Manufacturer Part Number: CAT6219-330TDGT3; Base Part Number: CAT6219; Current - Output: 500mA; Package / Case: SOT-23-5 Thin, TSOT-23-5; Supplier: Digi-Key; Supplier Device Package: TSOT-23-5; Voltage - Output (Min/Fixed): 3.3V; ComponentLink1URL: http://www.onsemi.com/pub/Collateral/CAT6219-D.PDF; ComponentLink1Description: http://www.onsemi.com/pub/Collateral/CAT6219-D.PDF; Supplier 1: Digi-Key
U4 = DRV8833: Dual H-Bridge Motor Driver 1.5A
U?#1 = ADP2302ARDZ-5.0-R7: IC REG BUCK 5V 2A 8SOIC; Vendor: Analog Devices Inc; Frequency - Switching: 700kHz; Output Type: Fixed; Voltage - Input (Max): 20V; Manufacturer_Part_Number: ADP2302ARDZ-5.0-R7; Type: DEV; Value: Value; Supplier 1: Digi-Key; Current - Output: 2A; Voltage - Output (Min/Fixed): 5V; Supplier Part Number 1: ADP2302ARDZ-5.0-R7CT-ND
U?#2 = SN74LVC1T45: 1.8V - 5V level converter
Y1 = XT_CRYSTAL_12MHz: 12.00 MHZ 18PF HC49/4H SMD; Manufacturer: Abracon Corporation; Manufacturer PN: ABLS-8.000MHZ-B2-T; Supplier 1: Farnell; Supplier Part Number 1: 1842280; Storage Location: PCB Assembly WS; Supplier: ECE Dept; Supplier 2: Digi-Key; Supplier Part Number 2: 535-10218-1-ND; Value: 12MHz